# EAGLE design Temp_board_v4.0 (EAGLE 8.0.0)
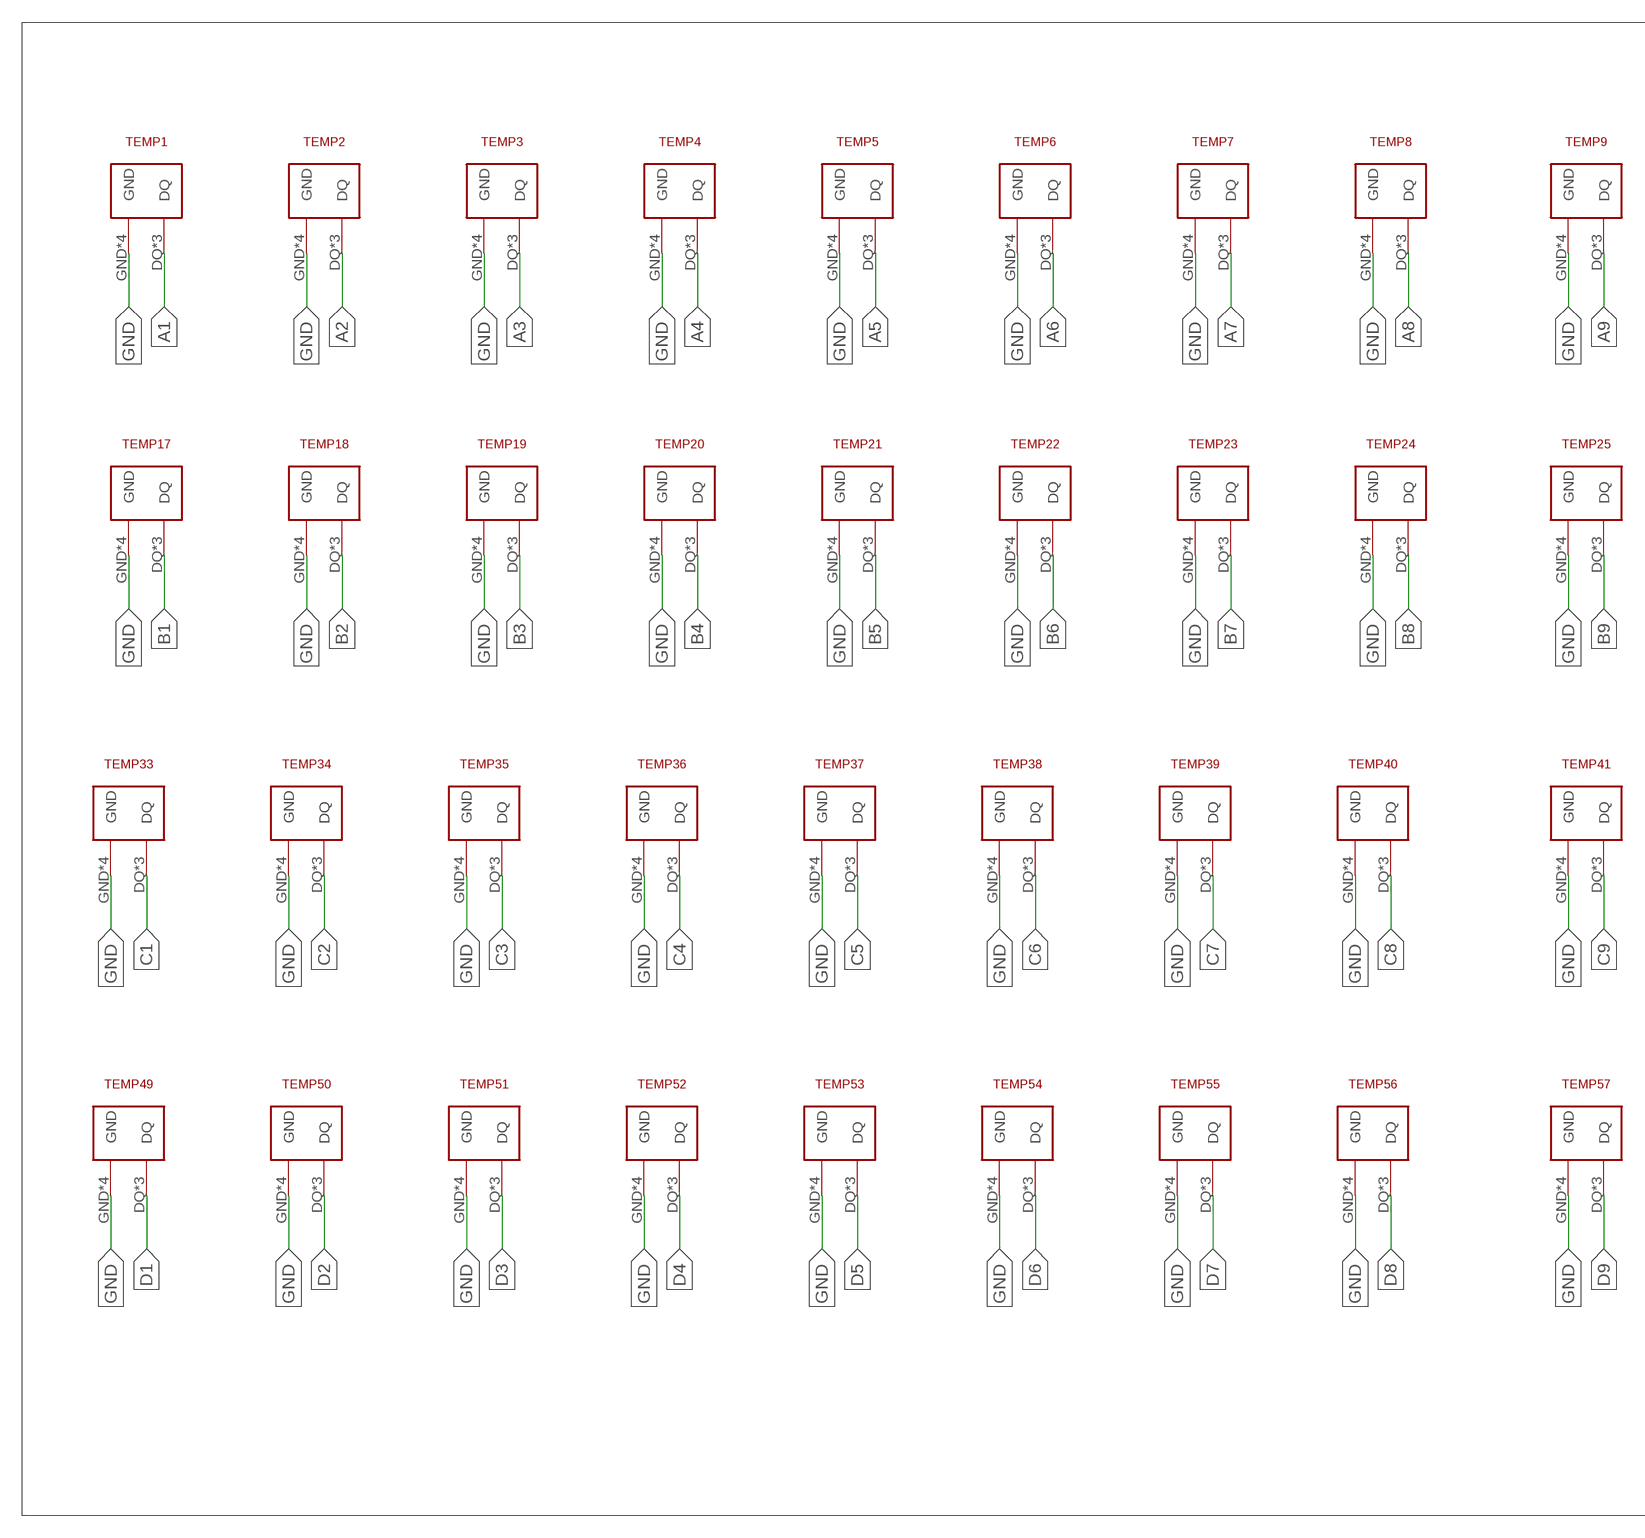
[diagram p0: schematic, sheet 1, part 1 of 2]
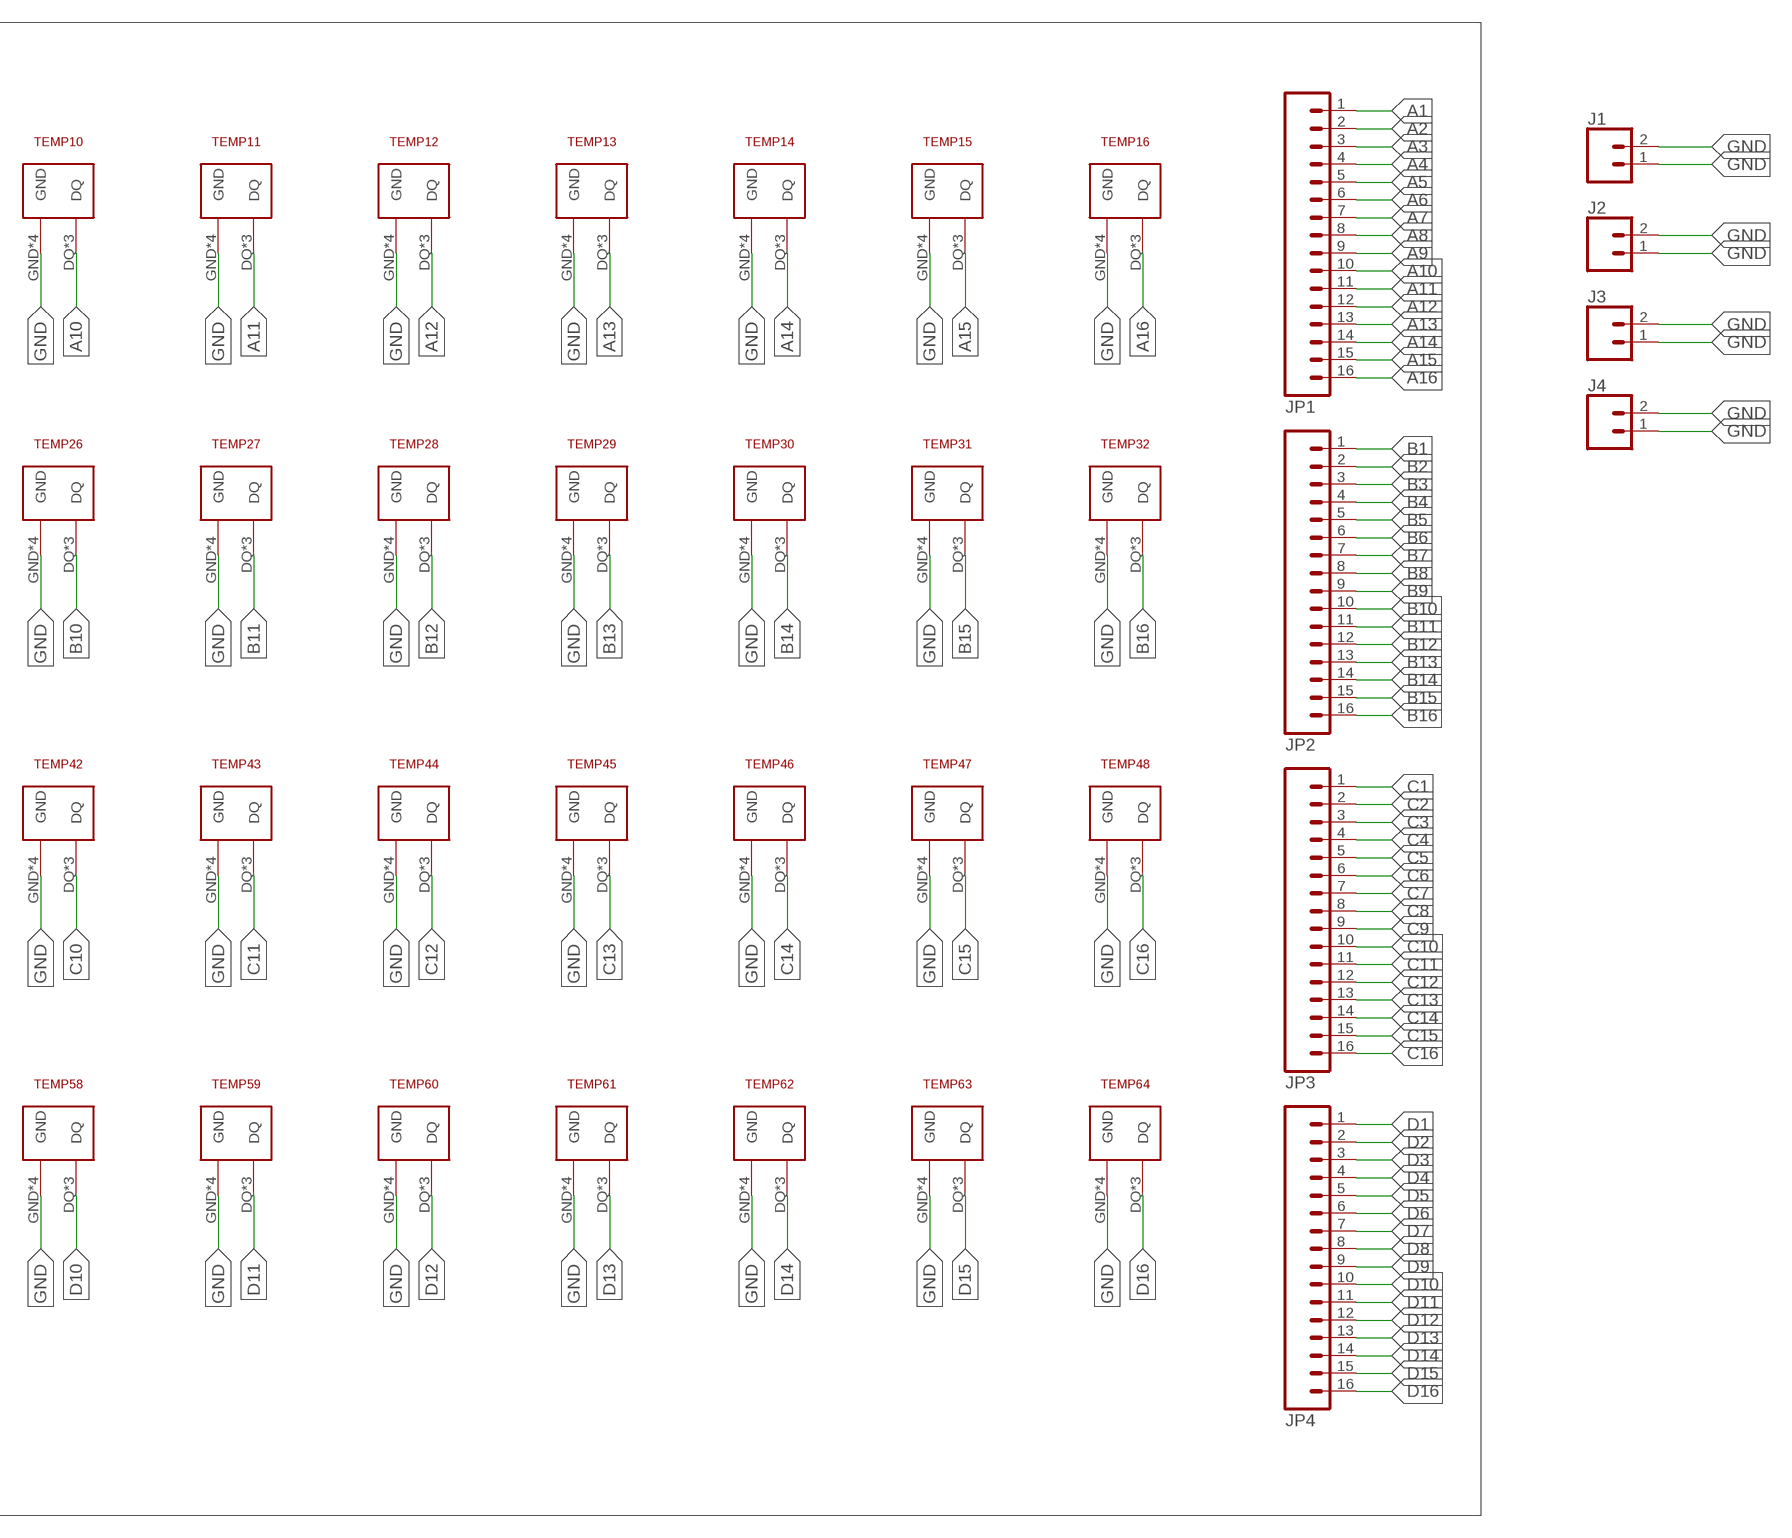
[diagram p1: schematic, sheet 1, part 2 of 2]

## Parts
J1  CONN_02  [1X02]
J2  CONN_02  [1X02]
J3  CONN_02  [1X02]
J4  CONN_02  [1X02]
JP1  M16PTH  [1X16]
JP2  M16PTH  [1X16]
JP3  M16PTH  [1X16]
JP4  M16PTH  [1X16]
TEMP1  TEMP_TEST_ALL  [TEMP_TEST_PACKAGE]
TEMP2  TEMP_TEST_ALL  [TEMP_TEST_PACKAGE]
TEMP3  TEMP_TEST_ALL  [TEMP_TEST_PACKAGE]
TEMP4  TEMP_TEST_ALL  [TEMP_TEST_PACKAGE]
TEMP5  TEMP_TEST_ALL  [TEMP_TEST_PACKAGE]
TEMP6  TEMP_TEST_ALL  [TEMP_TEST_PACKAGE]
TEMP7  TEMP_TEST_ALL  [TEMP_TEST_PACKAGE]
TEMP8  TEMP_TEST_ALL  [TEMP_TEST_PACKAGE]
TEMP9  TEMP_TEST_ALL  [TEMP_TEST_PACKAGE]
TEMP10  TEMP_TEST_ALL  [TEMP_TEST_PACKAGE]
TEMP11  TEMP_TEST_ALL  [TEMP_TEST_PACKAGE]
TEMP12  TEMP_TEST_ALL  [TEMP_TEST_PACKAGE]
TEMP13  TEMP_TEST_ALL  [TEMP_TEST_PACKAGE]
TEMP14  TEMP_TEST_ALL  [TEMP_TEST_PACKAGE]
TEMP15  TEMP_TEST_ALL  [TEMP_TEST_PACKAGE]
TEMP16  TEMP_TEST_ALL  [TEMP_TEST_PACKAGE]
TEMP17  TEMP_TEST_ALL  [TEMP_TEST_PACKAGE]
TEMP18  TEMP_TEST_ALL  [TEMP_TEST_PACKAGE]
TEMP19  TEMP_TEST_ALL  [TEMP_TEST_PACKAGE]
TEMP20  TEMP_TEST_ALL  [TEMP_TEST_PACKAGE]
TEMP21  TEMP_TEST_ALL  [TEMP_TEST_PACKAGE]
TEMP22  TEMP_TEST_ALL  [TEMP_TEST_PACKAGE]
TEMP23  TEMP_TEST_ALL  [TEMP_TEST_PACKAGE]
TEMP24  TEMP_TEST_ALL  [TEMP_TEST_PACKAGE]
TEMP25  TEMP_TEST_ALL  [TEMP_TEST_PACKAGE]
TEMP26  TEMP_TEST_ALL  [TEMP_TEST_PACKAGE]
TEMP27  TEMP_TEST_ALL  [TEMP_TEST_PACKAGE]
TEMP28  TEMP_TEST_ALL  [TEMP_TEST_PACKAGE]
TEMP29  TEMP_TEST_ALL  [TEMP_TEST_PACKAGE]
TEMP30  TEMP_TEST_ALL  [TEMP_TEST_PACKAGE]
TEMP31  TEMP_TEST_ALL  [TEMP_TEST_PACKAGE]
TEMP32  TEMP_TEST_ALL  [TEMP_TEST_PACKAGE]
TEMP33  TEMP_TEST_ALL  [TEMP_TEST_PACKAGE]
TEMP34  TEMP_TEST_ALL  [TEMP_TEST_PACKAGE]
TEMP35  TEMP_TEST_ALL  [TEMP_TEST_PACKAGE]
TEMP36  TEMP_TEST_ALL  [TEMP_TEST_PACKAGE]
TEMP37  TEMP_TEST_ALL  [TEMP_TEST_PACKAGE]
TEMP38  TEMP_TEST_ALL  [TEMP_TEST_PACKAGE]
TEMP39  TEMP_TEST_ALL  [TEMP_TEST_PACKAGE]
TEMP40  TEMP_TEST_ALL  [TEMP_TEST_PACKAGE]
TEMP41  TEMP_TEST_ALL  [TEMP_TEST_PACKAGE]
TEMP42  TEMP_TEST_ALL  [TEMP_TEST_PACKAGE]
TEMP43  TEMP_TEST_ALL  [TEMP_TEST_PACKAGE]
TEMP44  TEMP_TEST_ALL  [TEMP_TEST_PACKAGE]
TEMP45  TEMP_TEST_ALL  [TEMP_TEST_PACKAGE]
TEMP46  TEMP_TEST_ALL  [TEMP_TEST_PACKAGE]
TEMP47  TEMP_TEST_ALL  [TEMP_TEST_PACKAGE]
TEMP48  TEMP_TEST_ALL  [TEMP_TEST_PACKAGE]
TEMP49  TEMP_TEST_ALL  [TEMP_TEST_PACKAGE]
TEMP50  TEMP_TEST_ALL  [TEMP_TEST_PACKAGE]
TEMP51  TEMP_TEST_ALL  [TEMP_TEST_PACKAGE]
TEMP52  TEMP_TEST_ALL  [TEMP_TEST_PACKAGE]
TEMP53  TEMP_TEST_ALL  [TEMP_TEST_PACKAGE]
TEMP54  TEMP_TEST_ALL  [TEMP_TEST_PACKAGE]
TEMP55  TEMP_TEST_ALL  [TEMP_TEST_PACKAGE]
TEMP56  TEMP_TEST_ALL  [TEMP_TEST_PACKAGE]
TEMP57  TEMP_TEST_ALL  [TEMP_TEST_PACKAGE]
TEMP58  TEMP_TEST_ALL  [TEMP_TEST_PACKAGE]
TEMP59  TEMP_TEST_ALL  [TEMP_TEST_PACKAGE]
TEMP60  TEMP_TEST_ALL  [TEMP_TEST_PACKAGE]
TEMP61  TEMP_TEST_ALL  [TEMP_TEST_PACKAGE]
TEMP62  TEMP_TEST_ALL  [TEMP_TEST_PACKAGE]
TEMP63  TEMP_TEST_ALL  [TEMP_TEST_PACKAGE]
TEMP64  TEMP_TEST_ALL  [TEMP_TEST_PACKAGE]

## Nets
A1: JP1.1 TEMP1.DQ TEMP1.DQ1(DQ) TEMP1.DQ2(DQ)
A2: JP1.2 TEMP2.DQ TEMP2.DQ1(DQ) TEMP2.DQ2(DQ)
A3: JP1.3 TEMP3.DQ TEMP3.DQ1(DQ) TEMP3.DQ2(DQ)
A4: JP1.4 TEMP4.DQ TEMP4.DQ1(DQ) TEMP4.DQ2(DQ)
A5: JP1.5 TEMP5.DQ TEMP5.DQ1(DQ) TEMP5.DQ2(DQ)
A6: JP1.6 TEMP6.DQ TEMP6.DQ1(DQ) TEMP6.DQ2(DQ)
A7: JP1.7 TEMP7.DQ TEMP7.DQ1(DQ) TEMP7.DQ2(DQ)
A8: JP1.8 TEMP8.DQ TEMP8.DQ1(DQ) TEMP8.DQ2(DQ)
A9: JP1.9 TEMP9.DQ TEMP9.DQ1(DQ) TEMP9.DQ2(DQ)
A10: JP1.10 TEMP10.DQ TEMP10.DQ1(DQ) TEMP10.DQ2(DQ)
A11: JP1.11 TEMP11.DQ TEMP11.DQ1(DQ) TEMP11.DQ2(DQ)
A12: JP1.12 TEMP12.DQ TEMP12.DQ1(DQ) TEMP12.DQ2(DQ)
A13: JP1.13 TEMP13.DQ TEMP13.DQ1(DQ) TEMP13.DQ2(DQ)
A14: JP1.14 TEMP14.DQ TEMP14.DQ1(DQ) TEMP14.DQ2(DQ)
A15: JP1.15 TEMP15.DQ TEMP15.DQ1(DQ) TEMP15.DQ2(DQ)
A16: JP1.16 TEMP16.DQ TEMP16.DQ1(DQ) TEMP16.DQ2(DQ)
B1: JP2.1 TEMP17.DQ TEMP17.DQ1(DQ) TEMP17.DQ2(DQ)
B2: JP2.2 TEMP18.DQ TEMP18.DQ1(DQ) TEMP18.DQ2(DQ)
B3: JP2.3 TEMP19.DQ TEMP19.DQ1(DQ) TEMP19.DQ2(DQ)
B4: JP2.4 TEMP20.DQ TEMP20.DQ1(DQ) TEMP20.DQ2(DQ)
B5: JP2.5 TEMP21.DQ TEMP21.DQ1(DQ) TEMP21.DQ2(DQ)
B6: JP2.6 TEMP22.DQ TEMP22.DQ1(DQ) TEMP22.DQ2(DQ)
B7: JP2.7 TEMP23.DQ TEMP23.DQ1(DQ) TEMP23.DQ2(DQ)
B8: JP2.8 TEMP24.DQ TEMP24.DQ1(DQ) TEMP24.DQ2(DQ)
B9: JP2.9 TEMP25.DQ TEMP25.DQ1(DQ) TEMP25.DQ2(DQ)
B10: JP2.10 TEMP26.DQ TEMP26.DQ1(DQ) TEMP26.DQ2(DQ)
B11: JP2.11 TEMP27.DQ TEMP27.DQ1(DQ) TEMP27.DQ2(DQ)
B12: JP2.12 TEMP28.DQ TEMP28.DQ1(DQ) TEMP28.DQ2(DQ)
B13: JP2.13 TEMP29.DQ TEMP29.DQ1(DQ) TEMP29.DQ2(DQ)
B14: JP2.14 TEMP30.DQ TEMP30.DQ1(DQ) TEMP30.DQ2(DQ)
B15: JP2.15 TEMP31.DQ TEMP31.DQ1(DQ) TEMP31.DQ2(DQ)
B16: JP2.16 TEMP32.DQ TEMP32.DQ1(DQ) TEMP32.DQ2(DQ)
C1: JP3.1 TEMP33.DQ TEMP33.DQ1(DQ) TEMP33.DQ2(DQ)
C2: JP3.2 TEMP34.DQ TEMP34.DQ1(DQ) TEMP34.DQ2(DQ)
C3: JP3.3 TEMP35.DQ TEMP35.DQ1(DQ) TEMP35.DQ2(DQ)
C4: JP3.4 TEMP36.DQ TEMP36.DQ1(DQ) TEMP36.DQ2(DQ)
C5: JP3.5 TEMP37.DQ TEMP37.DQ1(DQ) TEMP37.DQ2(DQ)
C6: JP3.6 TEMP38.DQ TEMP38.DQ1(DQ) TEMP38.DQ2(DQ)
C7: JP3.7 TEMP39.DQ TEMP39.DQ1(DQ) TEMP39.DQ2(DQ)
C8: JP3.8 TEMP40.DQ TEMP40.DQ1(DQ) TEMP40.DQ2(DQ)
C9: JP3.9 TEMP41.DQ TEMP41.DQ1(DQ) TEMP41.DQ2(DQ)
C10: JP3.10 TEMP42.DQ TEMP42.DQ1(DQ) TEMP42.DQ2(DQ)
C11: JP3.11 TEMP43.DQ TEMP43.DQ1(DQ) TEMP43.DQ2(DQ)
C12: JP3.12 TEMP44.DQ TEMP44.DQ1(DQ) TEMP44.DQ2(DQ)
C13: JP3.13 TEMP45.DQ TEMP45.DQ1(DQ) TEMP45.DQ2(DQ)
C14: JP3.14 TEMP46.DQ TEMP46.DQ1(DQ) TEMP46.DQ2(DQ)
C15: JP3.15 TEMP47.DQ TEMP47.DQ1(DQ) TEMP47.DQ2(DQ)
C16: JP3.16 TEMP48.DQ TEMP48.DQ1(DQ) TEMP48.DQ2(DQ)
D1: JP4.1 TEMP49.DQ TEMP49.DQ1(DQ) TEMP49.DQ2(DQ)
D2: JP4.2 TEMP50.DQ TEMP50.DQ1(DQ) TEMP50.DQ2(DQ)
D3: JP4.3 TEMP51.DQ TEMP51.DQ1(DQ) TEMP51.DQ2(DQ)
D4: JP4.4 TEMP52.DQ TEMP52.DQ1(DQ) TEMP52.DQ2(DQ)
D5: JP4.5 TEMP53.DQ TEMP53.DQ1(DQ) TEMP53.DQ2(DQ)
D6: JP4.6 TEMP54.DQ TEMP54.DQ1(DQ) TEMP54.DQ2(DQ)
D7: JP4.7 TEMP55.DQ TEMP55.DQ1(DQ) TEMP55.DQ2(DQ)
D8: JP4.8 TEMP56.DQ TEMP56.DQ1(DQ) TEMP56.DQ2(DQ)
D9: JP4.9 TEMP57.DQ TEMP57.DQ1(DQ) TEMP57.DQ2(DQ)
D10: JP4.10 TEMP58.DQ TEMP58.DQ1(DQ) TEMP58.DQ2(DQ)
D11: JP4.11 TEMP59.DQ TEMP59.DQ1(DQ) TEMP59.DQ2(DQ)
D12: JP4.12 TEMP60.DQ TEMP60.DQ1(DQ) TEMP60.DQ2(DQ)
D13: JP4.13 TEMP61.DQ TEMP61.DQ1(DQ) TEMP61.DQ2(DQ)
D14: JP4.14 TEMP62.DQ TEMP62.DQ1(DQ) TEMP62.DQ2(DQ)
D15: JP4.15 TEMP63.DQ TEMP63.DQ1(DQ) TEMP63.DQ2(DQ)
D16: JP4.16 TEMP64.DQ TEMP64.DQ1(DQ) TEMP64.DQ2(DQ)
GND: J1.1 J1.2 J2.1 J2.2 J3.1 J3.2 J4.1 J4.2 TEMP1.GND TEMP1.GND1(GND) TEMP1.GND2(GND) TEMP1.VDD(GND) TEMP2.GND TEMP2.GND1(GND) TEMP2.GND2(GND) TEMP2.VDD(GND) TEMP3.GND TEMP3.GND1(GND) TEMP3.GND2(GND) TEMP3.VDD(GND) TEMP4.GND TEMP4.GND1(GND) TEMP4.GND2(GND) TEMP4.VDD(GND) TEMP5.GND TEMP5.GND1(GND) TEMP5.GND2(GND) TEMP5.VDD(GND) TEMP6.GND TEMP6.GND1(GND) TEMP6.GND2(GND) TEMP6.VDD(GND) TEMP7.GND TEMP7.GND1(GND) TEMP7.GND2(GND) TEMP7.VDD(GND) TEMP8.GND TEMP8.GND1(GND) TEMP8.GND2(GND) TEMP8.VDD(GND) TEMP9.GND TEMP9.GND1(GND) TEMP9.GND2(GND) TEMP9.VDD(GND) TEMP10.GND TEMP10.GND1(GND) TEMP10.GND2(GND) TEMP10.VDD(GND) TEMP11.GND TEMP11.GND1(GND) TEMP11.GND2(GND) TEMP11.VDD(GND) TEMP12.GND TEMP12.GND1(GND) TEMP12.GND2(GND) TEMP12.VDD(GND) TEMP13.GND TEMP13.GND1(GND) TEMP13.GND2(GND) TEMP13.VDD(GND) TEMP14.GND TEMP14.GND1(GND) TEMP14.GND2(GND) TEMP14.VDD(GND) TEMP15.GND TEMP15.GND1(GND) TEMP15.GND2(GND) TEMP15.VDD(GND) TEMP16.GND TEMP16.GND1(GND) TEMP16.GND2(GND) TEMP16.VDD(GND) TEMP17.GND TEMP17.GND1(GND) TEMP17.GND2(GND) TEMP17.VDD(GND) TEMP18.GND TEMP18.GND1(GND) TEMP18.GND2(GND) TEMP18.VDD(GND) TEMP19.GND TEMP19.GND1(GND) TEMP19.GND2(GND) TEMP19.VDD(GND) TEMP20.GND TEMP20.GND1(GND) TEMP20.GND2(GND) TEMP20.VDD(GND) TEMP21.GND TEMP21.GND1(GND) TEMP21.GND2(GND) TEMP21.VDD(GND) TEMP22.GND TEMP22.GND1(GND) TEMP22.GND2(GND) TEMP22.VDD(GND) TEMP23.GND TEMP23.GND1(GND) TEMP23.GND2(GND) TEMP23.VDD(GND) TEMP24.GND TEMP24.GND1(GND) TEMP24.GND2(GND) TEMP24.VDD(GND) TEMP25.GND TEMP25.GND1(GND) TEMP25.GND2(GND) TEMP25.VDD(GND) TEMP26.GND TEMP26.GND1(GND) TEMP26.GND2(GND) TEMP26.VDD(GND) TEMP27.GND TEMP27.GND1(GND) TEMP27.GND2(GND) TEMP27.VDD(GND) TEMP28.GND TEMP28.GND1(GND) TEMP28.GND2(GND) TEMP28.VDD(GND) TEMP29.GND TEMP29.GND1(GND) TEMP29.GND2(GND) TEMP29.VDD(GND) TEMP30.GND TEMP30.GND1(GND) TEMP30.GND2(GND) TEMP30.VDD(GND) TEMP31.GND TEMP31.GND1(GND) TEMP31.GND2(GND) TEMP31.VDD(GND) TEMP32.GND TEMP32.GND1(GND) TEMP32.GND2(GND) TEMP32.VDD(GND) TEMP33.GND TEMP33.GND1(GND) TEMP33.GND2(GND) TEMP33.VDD(GND) TEMP34.GND TEMP34.GND1(GND) TEMP34.GND2(GND) TEMP34.VDD(GND) TEMP35.GND TEMP35.GND1(GND) TEMP35.GND2(GND) TEMP35.VDD(GND) TEMP36.GND TEMP36.GND1(GND) TEMP36.GND2(GND) TEMP36.VDD(GND) TEMP37.GND TEMP37.GND1(GND) TEMP37.GND2(GND) TEMP37.VDD(GND) TEMP38.GND TEMP38.GND1(GND) TEMP38.GND2(GND) TEMP38.VDD(GND) TEMP39.GND TEMP39.GND1(GND) TEMP39.GND2(GND) TEMP39.VDD(GND) TEMP40.GND TEMP40.GND1(GND) TEMP40.GND2(GND) TEMP40.VDD(GND) TEMP41.GND TEMP41.GND1(GND) TEMP41.GND2(GND) TEMP41.VDD(GND) TEMP42.GND TEMP42.GND1(GND) TEMP42.GND2(GND) TEMP42.VDD(GND) TEMP43.GND TEMP43.GND1(GND) TEMP43.GND2(GND) TEMP43.VDD(GND) TEMP44.GND TEMP44.GND1(GND) TEMP44.GND2(GND) TEMP44.VDD(GND) TEMP45.GND TEMP45.GND1(GND) TEMP45.GND2(GND) TEMP45.VDD(GND) TEMP46.GND TEMP46.GND1(GND) TEMP46.GND2(GND) TEMP46.VDD(GND) TEMP47.GND TEMP47.GND1(GND) TEMP47.GND2(GND) TEMP47.VDD(GND) TEMP48.GND TEMP48.GND1(GND) TEMP48.GND2(GND) TEMP48.VDD(GND) TEMP49.GND TEMP49.GND1(GND) TEMP49.GND2(GND) TEMP49.VDD(GND) TEMP50.GND TEMP50.GND1(GND) TEMP50.GND2(GND) TEMP50.VDD(GND) TEMP51.GND TEMP51.GND1(GND) TEMP51.GND2(GND) TEMP51.VDD(GND) TEMP52.GND TEMP52.GND1(GND) TEMP52.GND2(GND) TEMP52.VDD(GND) TEMP53.GND TEMP53.GND1(GND) TEMP53.GND2(GND) TEMP53.VDD(GND) TEMP54.GND TEMP54.GND1(GND) TEMP54.GND2(GND) TEMP54.VDD(GND) TEMP55.GND TEMP55.GND1(GND) TEMP55.GND2(GND) TEMP55.VDD(GND) TEMP56.GND TEMP56.GND1(GND) TEMP56.GND2(GND) TEMP56.VDD(GND) TEMP57.GND TEMP57.GND1(GND) TEMP57.GND2(GND) TEMP57.VDD(GND) TEMP58.GND TEMP58.GND1(GND) TEMP58.GND2(GND) TEMP58.VDD(GND) TEMP59.GND TEMP59.GND1(GND) TEMP59.GND2(GND) TEMP59.VDD(GND) TEMP60.GND TEMP60.GND1(GND) TEMP60.GND2(GND) TEMP60.VDD(GND) TEMP61.GND TEMP61.GND1(GND) TEMP61.GND2(GND) TEMP61.VDD(GND) TEMP62.GND TEMP62.GND1(GND) TEMP62.GND2(GND) TEMP62.VDD(GND) TEMP63.GND TEMP63.GND1(GND) TEMP63.GND2(GND) TEMP63.VDD(GND) TEMP64.GND TEMP64.GND1(GND) TEMP64.GND2(GND) TEMP64.VDD(GND)

## Library data of the parts
J1-J4 = SparkFun-Connectors:CONN_02: Multi connection point. Often used as Generic Header-pin footprint for 0.1 inch spaced/style header connections On any of the 0.1 inch spaced packages, you can populate with these: Break Away Headers - Straight <https://www.sparkfun.com/products/116> (PRT-00116) Break Away Male Headers - Right Angle <https://www.sparkfun.com/products/553> (PRT-00553) Female Headers <https://www.sparkfun.com/products/115> (PRT-00115) Break Away Headers - Machine Pin <https://www.sparkfun.com/products/117> (PRT-00117) Break Away Female Headers - Swiss Machine Pin <https://www.sparkfun.com/products/743> (PRT-00743) For SCREWTERMINALS and SPRING TERMINALS visit here: Screw Terimnals on SparkFun.com <https://www.sparkfun.com/search/results?term=Screw+Terminals> (5mm/3.5mm/2.54mm spacing) This device is also useful as a general connection point to wire up your design to another part of your project. Our various solder wires solder well into these plated through hole pads. Hook-Up Wire - Assortment (Stranded, 22 AWG) <https://www.sparkfun.com/products/11375> (PRT-11375) Hook-Up Wire - Assortment (Solid Core, 22 AWG) <https://www.sparkfun.com/products/11367> (PRT-11367) View the entire wire category on our website here <https://www.sparkfun.com/categories/141> Special notes: Molex polarized connector foot print use with: PRT-08233 with associated crimp pins and housings. 2.54_SCREWTERM for use with PRT-10571. 3.5mm Screw Terminal footprints for PRT-08084 5mm Screw Terminal footprints for use with PRT-08432
JP1-JP4 = SparkFun-Connectors:M16: 1x16 .1" header
TEMP1-TEMP64 = UIO-John:TEMP_TEST_ALL

## Board
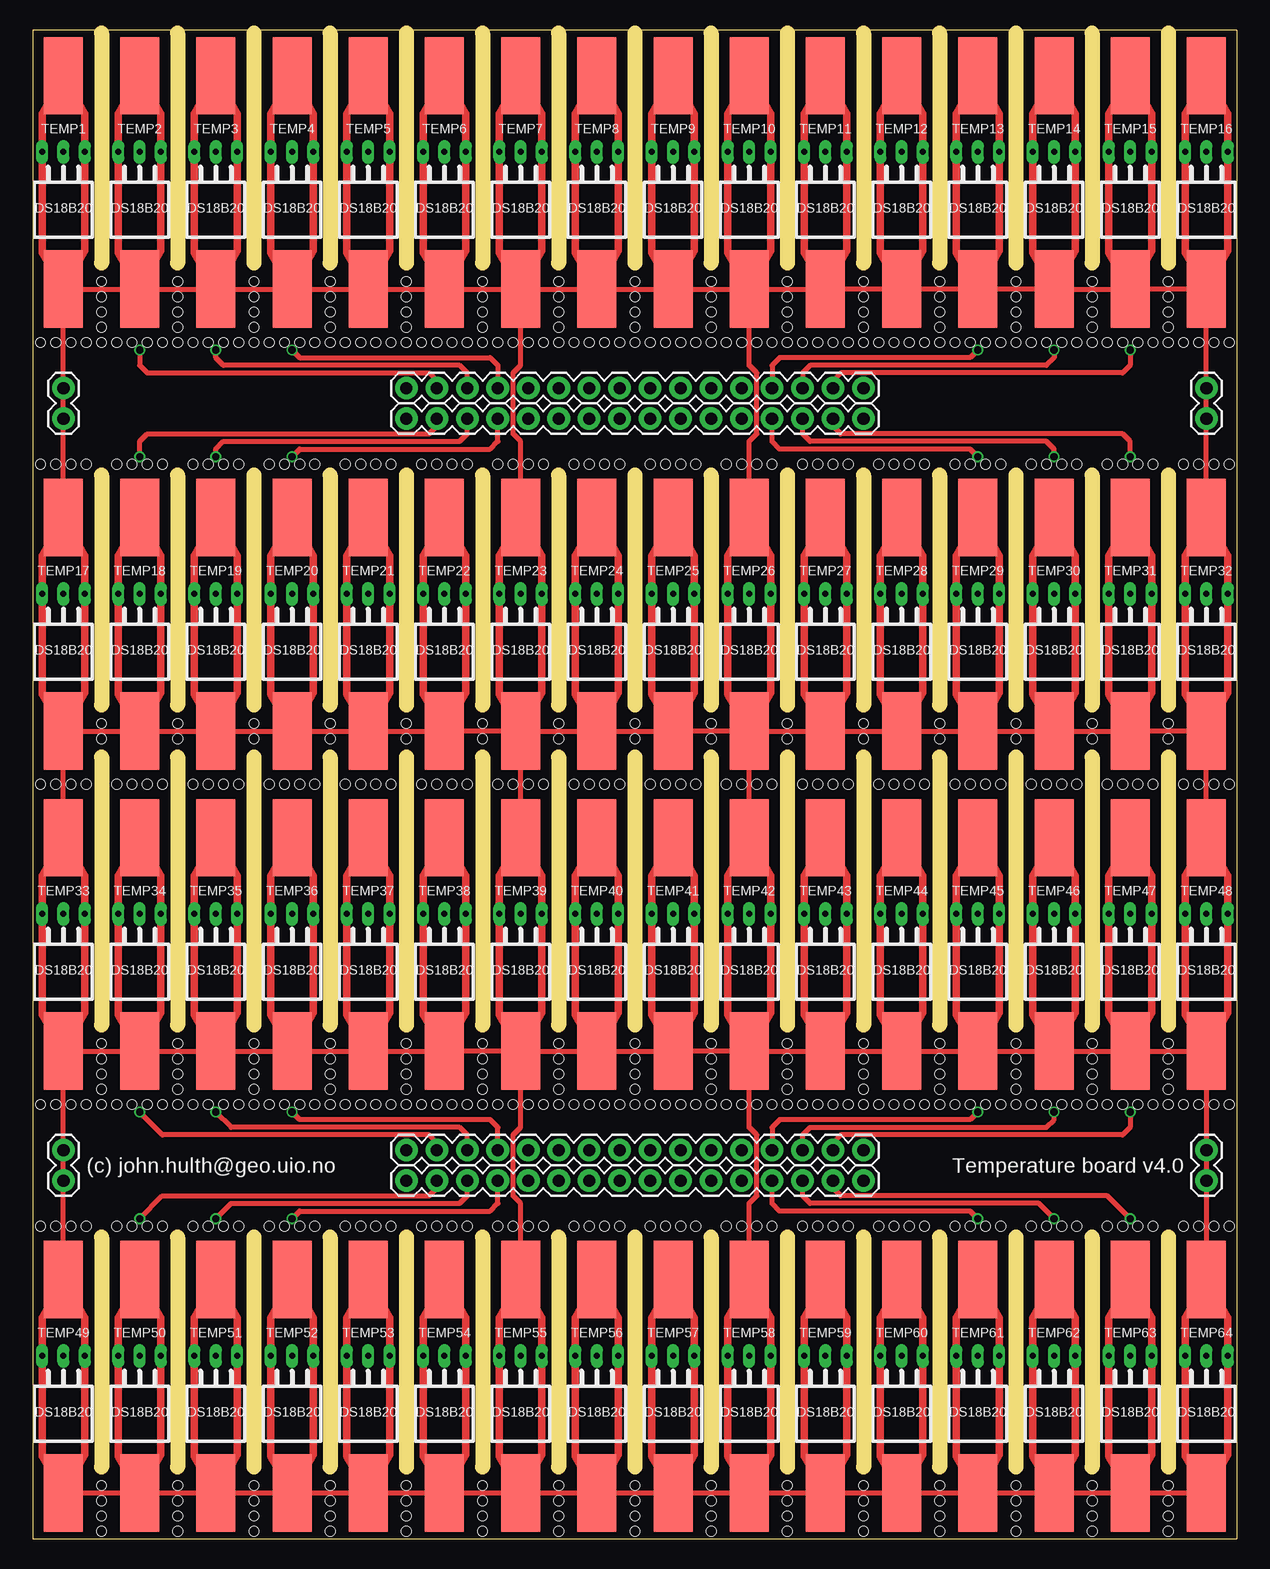
[diagram p2: board, top side]
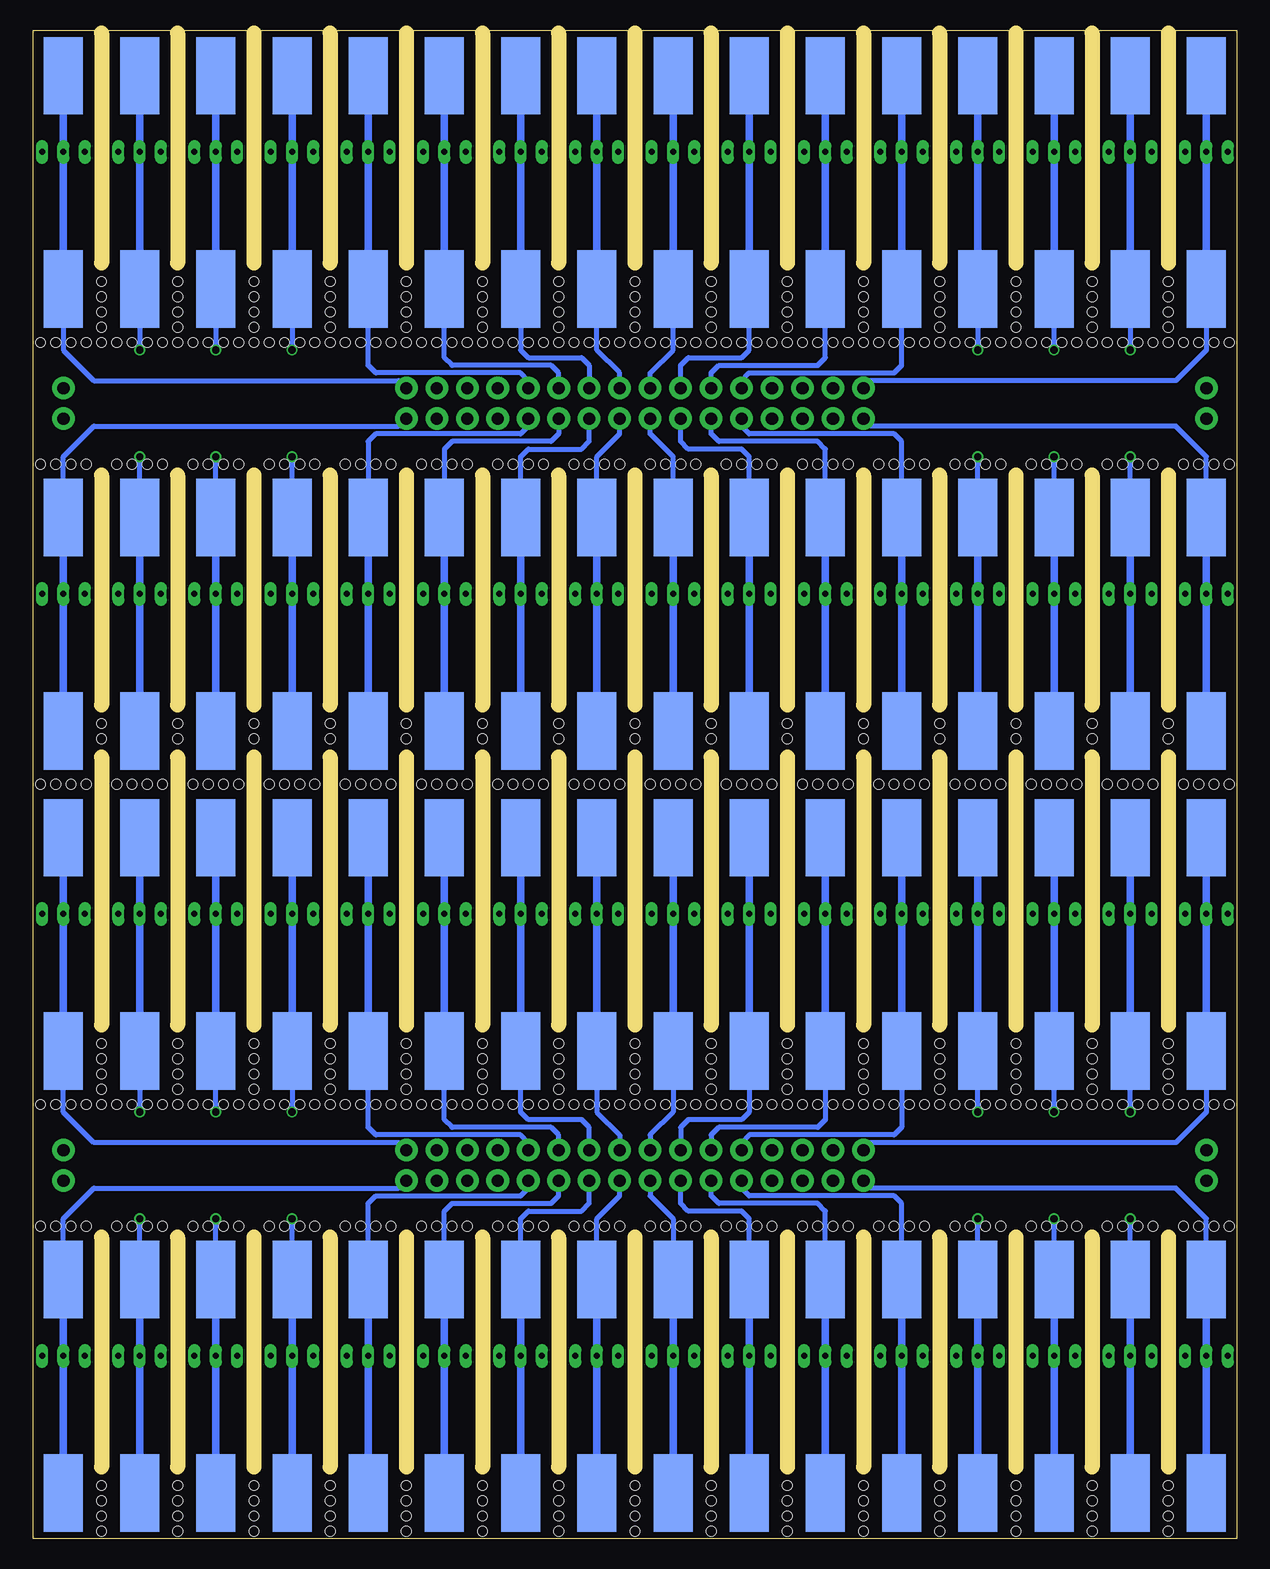
[diagram p3: board, bottom side, seen from below]

Size 100.33 x 125.73 mm. Coordinates in mm from the lower left corner, seen from the top.
Outline: 0,0 100.33,0 100.33,125.73 0,125.73 0,0
Copper layers (1*16): Top 0.035mm / dielectric 1.5mm / Bottom 0.035mm
Design rules "dirt_cheap_dirty_boards.v1": minimum track width 5mil, minimum drill 12mil, track to track 5mil, track to pad 5mil, pad to pad 5mil, via to via 5mil, smd to smd 0mil, copper to edge 10mil, drill to drill 10mil, minimum pad ring 10mil, minimum via ring 6mil, stop-mask expansion 2mil, vias tented up to drill 25mil, thermal gap 10mil
Holes 0.8 mm at 5.71,104.78 5.71,103.5 62.87,104.78 62.87,103.5 3.17,89.53 4.45,89.53 0.64,89.53 1.91,89.53 12.06,104.78 12.06,103.5 69.22,104.78 69.22,103.5 9.53,89.53 10.79,89.53 6.99,89.53 8.26,89.53 18.41,104.78 18.41,103.5 75.56,104.78 75.56,103.5 15.88,89.53 17.14,89.53 13.34,89.53 14.61,89.53 24.77,104.78 24.77,103.5 81.92,104.78 81.92,103.5 22.23,89.53 23.5,89.53 19.68,89.53 20.95,89.53 31.11,104.78 31.11,103.5 88.27,104.78 88.27,103.5 28.57,89.53 29.84,89.53 26.04,89.53 27.3,89.53 37.47,104.78 37.47,103.5 94.61,104.78 94.61,103.5 34.92,89.53 36.2,89.53 32.38,89.53 33.66,89.53 43.81,104.78 43.81,103.5 41.27,89.53 42.55,89.53 38.73,89.53 40.01,89.53 50.16,104.78 50.16,103.5 47.62,89.53 48.9,89.53 45.09,89.53 46.35,89.53 3.17,26.04 4.45,26.04 0.64,26.04 1.91,26.04 9.53,26.04 10.79,26.04 6.99,26.04 8.26,26.04 15.88,26.04 17.14,26.04 13.34,26.04 14.61,26.04 22.23,26.04 23.5,26.04 19.68,26.04 20.95,26.04 28.57,26.04 29.84,26.04 26.04,26.04 27.3,26.04 34.92,26.04 36.2,26.04 32.38,26.04 33.66,26.04 41.27,26.04 42.55,26.04 38.73,26.04 40.01,26.04 47.62,26.04 48.9,26.04 45.09,26.04 46.35,26.04 5.71,67.94 5.71,66.67 60.33,89.53 61.59,89.53 57.78,89.53 59.05,89.53 12.06,67.94 12.06,66.67 66.67,89.53 67.94,89.53 64.14,89.53 65.41,89.53 18.41,67.94 18.41,66.67 73.03,89.53 74.3,89.53 70.48,89.53 71.75,89.53 24.77,67.94 24.77,66.67 79.38,89.53 80.64,89.53 76.83,89.53 78.11,89.53 31.11,67.94 31.11,66.67 85.72,89.53 87,89.53 83.19,89.53 84.45,89.53 37.47,67.94 37.47,66.67 92.08,89.53 93.34,89.53 89.53,89.53 90.81,89.53 43.81,67.94 43.81,66.67 98.42,89.53 99.69,89.53 95.89,89.53 97.16,89.53 50.16,67.94 50.16,66.67 5.71,4.45 5.71,3.17 53.98,26.04 55.24,26.04 51.44,26.04 52.7,26.04 12.06,4.45 12.06,3.17 60.33,26.04 61.59,26.04 57.78,26.04 59.05,26.04 18.41,4.45 18.41,3.17 66.67,26.04 67.94,26.04 64.14,26.04 65.41,26.04 24.77,4.45 24.77,3.17 73.03,26.04 74.3,26.04 70.48,26.04 71.75,26.04 31.11,4.45 31.11,3.17 79.38,26.04 80.64,26.04 76.83,26.04 78.11,26.04 37.47,4.45 37.47,3.17 85.72,26.04 87,26.04 83.19,26.04 84.45,26.04 43.81,4.45 43.81,3.17 92.08,26.04 93.34,26.04 89.53,26.04 90.81,26.04 50.16,4.45 50.16,3.17 98.42,26.04 99.69,26.04 95.89,26.04 97.16,26.04 56.52,67.94 56.52,66.67 3.17,62.87 4.45,62.87 0.64,62.87 1.91,62.87 62.87,67.94 62.87,66.67 9.53,62.87 10.79,62.87 6.99,62.87 8.26,62.87 69.22,67.94 69.22,66.67 15.88,62.87 17.14,62.87 13.34,62.87 14.61,62.87 75.56,67.94 75.56,66.67 22.23,62.87 23.5,62.87 19.68,62.87 20.95,62.87 81.92,67.94 81.92,66.67 28.57,62.87 29.84,62.87 26.04,62.87 27.3,62.87 88.27,67.94 88.27,66.67 34.92,62.87 36.2,62.87 32.38,62.87 33.66,62.87 94.61,67.94 94.61,66.67 41.27,62.87 42.55,62.87 38.73,62.87 40.01,62.87 47.62,62.87 48.9,62.87 45.09,62.87 46.35,62.87 56.52,4.45 56.52,3.17 62.87,4.45 62.87,3.17 69.22,4.45 69.22,3.17 75.56,4.45 75.56,3.17 81.92,4.45 81.92,3.17 88.27,4.45 88.27,3.17 94.61,4.45 94.61,3.17 50.16,67.94 50.16,66.67 56.52,104.78 56.52,103.5 53.98,62.87 55.24,62.87 51.44,62.87 52.7,62.87 60.33,62.87 61.59,62.87 57.78,62.87 59.05,62.87 66.67,62.87 67.94,62.87 64.14,62.87 65.41,62.87 73.03,62.87 74.3,62.87 70.48,62.87 71.75,62.87 79.38,62.87 80.64,62.87 76.83,62.87 78.11,62.87 85.72,62.87 87,62.87 83.19,62.87 84.45,62.87 92.08,62.87 93.34,62.87 89.53,62.87 90.81,62.87 98.42,62.87 99.69,62.87 95.89,62.87 97.16,62.87 50.16,4.45 50.16,3.17 81.92,1.91 81.92,0.64 88.27,1.91 88.27,0.64 94.61,1.91 94.61,0.64 56.52,1.91 56.52,0.64 62.87,1.91 62.87,0.64 69.22,1.91 69.22,0.64 75.56,1.91 75.56,0.64 50.16,1.91 50.16,0.64 53.98,89.53 55.24,89.53 51.44,89.53 52.7,89.53 43.81,1.91 43.81,0.64 18.41,1.91 18.41,0.64 24.77,1.91 24.77,0.64 31.11,1.91 31.11,0.64 37.47,1.91 37.47,0.64 12.06,1.91 12.06,0.64 5.71,1.91 5.71,0.64 3.17,99.69 4.45,99.69 0.64,99.69 1.91,99.69 9.53,99.69 10.79,99.69 6.99,99.69 8.26,99.69 15.88,99.69 17.14,99.69 13.34,99.69 14.61,99.69 22.23,99.69 23.5,99.69 19.68,99.69 20.95,99.69 28.57,99.69 29.84,99.69 26.04,99.69 27.3,99.69 34.92,99.69 36.2,99.69 32.38,99.69 33.66,99.69 41.27,99.69 42.55,99.69 38.73,99.69 40.01,99.69 47.62,99.69 48.9,99.69 45.09,99.69 46.35,99.69 60.33,99.69 61.59,99.69 57.78,99.69 59.05,99.69 66.67,99.69 67.94,99.69 64.14,99.69 65.41,99.69 73.03,99.69 74.3,99.69 70.48,99.69 71.75,99.69 79.38,99.69 80.64,99.69 76.83,99.69 78.11,99.69 85.72,99.69 87,99.69 83.19,99.69 84.45,99.69 92.08,99.69 93.34,99.69 89.53,99.69 90.81,99.69 98.42,99.69 99.69,99.69 95.89,99.69 97.16,99.69 53.98,99.69 55.24,99.69 51.44,99.69 52.7,99.69 3.17,36.2 4.45,36.2 0.64,36.2 1.91,36.2 9.53,36.2 10.79,36.2 6.99,36.2 8.26,36.2 15.88,36.2 17.14,36.2 13.34,36.2 14.61,36.2 22.23,36.2 23.5,36.2 19.68,36.2 20.95,36.2 28.57,36.2 29.84,36.2 26.04,36.2 27.3,36.2 34.92,36.2 36.2,36.2 32.38,36.2 33.66,36.2 41.27,36.2 42.55,36.2 38.73,36.2 40.01,36.2 47.62,36.2 48.9,36.2 45.09,36.2 46.35,36.2 53.98,36.2 55.24,36.2 51.44,36.2 52.7,36.2 60.33,36.2 61.59,36.2 57.78,36.2 59.05,36.2 66.67,36.2 67.94,36.2 64.14,36.2 65.41,36.2 73.03,36.2 74.3,36.2 70.48,36.2 71.75,36.2 79.38,36.2 80.64,36.2 76.83,36.2 78.11,36.2 85.72,36.2 87,36.2 83.19,36.2 84.45,36.2 92.08,36.2 93.34,36.2 89.53,36.2 90.81,36.2 98.42,36.2 99.69,36.2 95.89,36.2 97.16,36.2 5.71,41.27 5.71,40.01 62.87,41.27 62.87,40.01 12.06,41.27 12.06,40.01 69.22,41.27 69.22,40.01 18.41,41.27 18.41,40.01 75.56,41.27 75.56,40.01 24.77,41.27 24.77,40.01 81.92,41.27 81.92,40.01 31.11,41.27 31.11,40.01 88.27,41.27 88.27,40.01 37.47,41.27 37.47,40.01 94.61,41.27 94.61,40.01 43.81,41.27 43.81,40.01 50.16,41.27 50.16,40.01 56.52,41.27 56.52,40.01 5.71,38.73 5.71,37.47 62.87,38.73 62.87,37.47 12.06,38.73 12.06,37.47 69.22,38.73 69.22,37.47 18.41,38.73 18.41,37.47 75.56,38.73 75.56,37.47 24.77,38.73 24.77,37.47 81.92,38.73 81.92,37.47 31.11,38.73 31.11,37.47 88.27,38.73 88.27,37.47 37.47,38.73 37.47,37.47 94.61,38.73 94.61,37.47 43.81,38.73 43.81,37.47 50.16,38.73 50.16,37.47 56.52,38.73 56.52,37.47 5.71,102.23 5.71,100.97 12.06,102.23 12.06,100.97 18.41,102.23 18.41,100.97 24.77,102.23 24.77,100.97 31.11,102.23 31.11,100.97 37.47,102.23 37.47,100.97 43.81,102.23 43.81,100.97 50.16,102.23 50.16,100.97 56.52,102.23 56.52,100.97 62.87,102.23 62.87,100.97 69.22,102.23 69.22,100.97 75.56,102.23 75.56,100.97 81.92,102.23 81.92,100.97 88.27,102.23 88.27,100.97 94.61,102.23 94.61,100.97 62.87,36.2 69.22,36.2 75.56,36.2 81.92,36.2 88.27,36.2 94.61,36.2 18.41,36.2 24.77,36.2 31.11,36.2 37.47,36.2 43.81,36.2 50.16,36.2 5.71,36.2 12.06,36.2 56.52,36.2 5.71,99.69 12.06,99.69 18.41,99.69 24.77,99.69 31.11,99.69 37.47,99.69 43.81,99.69 50.16,99.69 56.52,99.69 62.87,99.69 69.22,99.69 75.56,99.69 81.92,99.69 88.27,99.69 94.61,99.69
Milling: 60 lines

### Footprints (pad centres in the part's own frame; a part is rotated, then mirrored left to right if it is on the bottom)
1X02 = drill 1.016 pad 1.88: 1 0,0; 2 2.54,0
1X16 = drill 1.016 pad 1.88: 1 0,0; 2 2.54,0; 3 5.08,0; 4 7.62,0; 5 10.16,0; 6 12.7,0; 7 15.24,0; 8 17.78,0; 9 20.32,0; 10 22.86,0; 11 25.4,0; 12 27.94,0; 13 30.48,0; 14 33.02,0; 15 35.56,0; 16 38.1,0
TEMP_TEST_PACKAGE = drill 0.5 pad 0.813 long: DQ 0,0; GND -1.778,0; VDD 1.778,0 | smd 3.251 x 6.452 bottom: DQ1 0,-11.43; DQ2 0,6.35 | smd 3.251 x 6.452: GND1 0,-11.43; GND2 0,6.35

### Placement (x,y rotation side)
J1  2.54,93.34 90 top
J2  97.79,93.34 90 top
J3  2.54,29.84 90 top
J4  97.79,29.84 90 top
JP1  31.11,95.89 0 top
JP2  31.11,93.34 0 top
JP3  31.11,32.38 0 top
JP4  31.11,29.84 0 top
TEMP1  2.54,115.57 0 top
TEMP2  8.89,115.57 0 top
TEMP3  15.24,115.57 0 top
TEMP4  21.59,115.57 0 top
TEMP5  27.94,115.57 0 top
TEMP6  34.29,115.57 0 top
TEMP7  40.64,115.57 0 top
TEMP8  46.99,115.57 0 top
TEMP9  53.34,115.57 0 top
TEMP10  59.69,115.57 0 top
TEMP11  66.04,115.57 0 top
TEMP12  72.39,115.57 0 top
TEMP13  78.74,115.57 0 top
TEMP14  85.09,115.57 0 top
TEMP15  91.44,115.57 0 top
TEMP16  97.79,115.57 0 top
TEMP17  2.54,78.74 0 top
TEMP18  8.89,78.74 0 top
TEMP19  15.24,78.74 0 top
TEMP20  21.59,78.74 0 top
TEMP21  27.94,78.74 0 top
TEMP22  34.29,78.74 0 top
TEMP23  40.64,78.74 0 top
TEMP24  46.99,78.74 0 top
TEMP25  53.34,78.74 0 top
TEMP26  59.69,78.74 0 top
TEMP27  66.04,78.74 0 top
TEMP28  72.39,78.74 0 top
TEMP29  78.74,78.74 0 top
TEMP30  85.09,78.74 0 top
TEMP31  91.44,78.74 0 top
TEMP32  97.79,78.74 0 top
TEMP33  2.54,52.07 0 top
TEMP34  8.89,52.07 0 top
TEMP35  15.24,52.07 0 top
TEMP36  21.59,52.07 0 top
TEMP37  27.94,52.07 0 top
TEMP38  34.29,52.07 0 top
TEMP39  40.64,52.07 0 top
TEMP40  46.99,52.07 0 top
TEMP41  53.34,52.07 0 top
TEMP42  59.69,52.07 0 top
TEMP43  66.04,52.07 0 top
TEMP44  72.39,52.07 0 top
TEMP45  78.74,52.07 0 top
TEMP46  85.09,52.07 0 top
TEMP47  91.44,52.07 0 top
TEMP48  97.79,52.07 0 top
TEMP49  2.54,15.24 0 top
TEMP50  8.89,15.24 0 top
TEMP51  15.24,15.24 0 top
TEMP52  21.59,15.24 0 top
TEMP53  27.94,15.24 0 top
TEMP54  34.29,15.24 0 top
TEMP55  40.64,15.24 0 top
TEMP56  46.99,15.24 0 top
TEMP57  53.34,15.24 0 top
TEMP58  59.69,15.24 0 top
TEMP59  66.04,15.24 0 top
TEMP60  72.39,15.24 0 top
TEMP61  78.74,15.24 0 top
TEMP62  85.09,15.24 0 top
TEMP63  91.44,15.24 0 top
TEMP64  97.79,15.24 0 top

### Tracks (layer width: path | path; a pad name or v marks a point on that pad's centre or on a via)
A1
  Bottom 0.127: TEMP1.DQ TEMP1.DQ1
  Bottom 0.406: TEMP1.DQ1 2.54,99.06 5.08,96.52 30.48,96.52 JP1.1
A2  (via drill 0.6)
  Top 0.406: v8.89,99.06 8.89,97.79 9.53,97.16 33.02,97.16 33.66,96.52 JP1.2
  Bottom 0.127: TEMP2.DQ TEMP2.DQ1
  Bottom 0.406: TEMP2.DQ1 v8.89,99.06
A3  (via drill 0.6)
  Top 0.406: JP1.3 36.2,97.16 35.56,97.79 15.88,97.79 15.24,98.42 v15.24,99.06
  Bottom 0.127: TEMP3.DQ1 TEMP3.DQ
  Bottom 0.406: v15.24,99.06 TEMP3.DQ1
A4  (via drill 0.6)
  Top 0.406: v21.59,99.06 22.23,98.42 38.1,98.42 38.73,97.79 JP1.4
  Bottom 0.127: TEMP4.DQ TEMP4.DQ1
  Bottom 0.406: TEMP4.DQ1 v21.59,99.06
A5
  Bottom 0.127: TEMP5.DQ1 TEMP5.DQ
  Bottom 0.406: JP1.5 41.27,96.52 40.64,97.16 28.57,97.16 27.94,97.79 TEMP5.DQ1
A6
  Bottom 0.127: TEMP6.DQ1 TEMP6.DQ
  Bottom 0.406: JP1.6 43.81,97.16 43.18,97.79 34.92,97.79 34.29,98.42 TEMP6.DQ1
A7
  Bottom 0.127: TEMP7.DQ1 TEMP7.DQ
  Bottom 0.406: JP1.7 46.35,97.79 45.72,98.42 41.27,98.42 40.64,99.06 TEMP7.DQ1
A8
  Bottom 0.127: TEMP8.DQ1 TEMP8.DQ
  Bottom 0.406: TEMP8.DQ1 46.99,99.06 48.9,97.16 JP1.8
A9
  Bottom 0.127: TEMP9.DQ1 TEMP9.DQ
  Bottom 0.406: TEMP9.DQ1 53.34,99.06 51.44,97.16 JP1.9
A10
  Bottom 0.127: TEMP10.DQ TEMP10.DQ1
  Bottom 0.406: JP1.10 53.98,97.79 54.61,98.42 59.05,98.42 59.69,99.06 TEMP10.DQ1
A11
  Bottom 0.127: TEMP11.DQ1 TEMP11.DQ
  Bottom 0.406: TEMP11.DQ1 66.04,98.42 65.41,97.79 57.15,97.79 56.52,97.16 JP1.11
A12
  Bottom 0.127: TEMP12.DQ1 TEMP12.DQ
  Bottom 0.406: JP1.12 59.05,96.52 59.69,97.16 71.75,97.16 72.39,97.79 TEMP12.DQ1
A13  (via drill 0.6)
  Top 0.406: v78.74,99.06 78.11,98.42 62.23,98.42 61.59,97.79 JP1.13
  Bottom 0.127: TEMP13.DQ TEMP13.DQ1
  Bottom 0.406: TEMP13.DQ1 v78.74,99.06
A14  (via drill 0.6)
  Top 0.406: v85.09,99.06 85.09,98.42 84.45,97.79 64.77,97.79 64.14,97.16 JP1.14
  Bottom 0.127: TEMP14.DQ TEMP14.DQ1
  Bottom 0.406: TEMP14.DQ1 v85.09,99.06
A15  (via drill 0.6)
  Top 0.406: v91.44,99.06 91.44,97.79 90.81,97.16 67.31,97.16 66.67,96.52 JP1.15
  Bottom 0.127: TEMP15.DQ TEMP15.DQ1
  Bottom 0.406: TEMP15.DQ1 v91.44,99.06
A16
  Bottom 0.127: TEMP16.DQ TEMP16.DQ1
  Bottom 0.406: TEMP16.DQ1 97.79,99.06 95.25,96.52 69.85,96.52 JP1.16
B1
  Bottom 0.127: TEMP17.DQ TEMP17.DQ1
  Bottom 0.406: TEMP17.DQ2 2.54,90.17 5.08,92.71 30.48,92.71 JP2.1
B2  (via drill 0.6)
  Top 0.406: v8.89,90.17 8.89,91.44 9.53,92.08 33.02,92.08 33.66,92.71 JP2.2
  Bottom 0.127: TEMP18.DQ TEMP18.DQ1
  Bottom 0.406: TEMP18.DQ2 v8.89,90.17
B3  (via drill 0.6)
  Top 0.406: v15.24,90.17 15.24,90.81 15.88,91.44 35.56,91.44 36.2,92.08 JP2.3
  Bottom 0.127: TEMP19.DQ TEMP19.DQ1
  Bottom 0.406: TEMP19.DQ2 v15.24,90.17
B4  (via drill 0.6)
  Top 0.406: v21.59,90.17 22.23,90.81 38.1,90.81 38.73,91.44 JP2.4
  Bottom 0.127: TEMP20.DQ TEMP20.DQ1
  Bottom 0.406: TEMP20.DQ2 v21.59,90.17
B5
  Bottom 0.127: TEMP21.DQ TEMP21.DQ1
  Bottom 0.406: JP2.5 41.27,92.71 40.64,92.08 28.57,92.08 27.94,91.44 TEMP21.DQ2
B6
  Bottom 0.127: TEMP22.DQ TEMP22.DQ1
  Bottom 0.406: JP2.6 43.81,92.08 43.18,91.44 34.92,91.44 34.29,90.81 TEMP22.DQ2
B7
  Bottom 0.127: TEMP23.DQ TEMP23.DQ1
  Bottom 0.406: TEMP23.DQ2 40.64,90.17 41.27,90.81 45.72,90.81 46.35,91.44 JP2.7
B8
  Bottom 0.127: TEMP24.DQ TEMP24.DQ1
  Bottom 0.406: TEMP24.DQ2 46.99,90.17 48.9,92.08 JP2.8
B9
  Bottom 0.127: TEMP25.DQ TEMP25.DQ1
  Bottom 0.406: TEMP25.DQ2 53.34,90.17 51.44,92.08 JP2.9
B10
  Bottom 0.127: TEMP26.DQ TEMP26.DQ1
  Bottom 0.406: TEMP26.DQ2 59.69,90.17 59.05,90.81 54.61,90.81 53.98,91.44 JP2.10
B11
  Bottom 0.127: TEMP27.DQ TEMP27.DQ1
  Bottom 0.406: JP2.11 56.52,92.08 57.15,91.44 65.41,91.44 66.04,90.81 TEMP27.DQ2
B12
  Bottom 0.127: TEMP28.DQ TEMP28.DQ1
  Bottom 0.406: JP2.12 59.05,92.71 59.69,92.08 71.75,92.08 72.39,91.44 TEMP28.DQ2
B13  (via drill 0.6)
  Top 0.406: v78.74,90.17 78.11,90.81 62.23,90.81 61.59,91.44 JP2.13
  Bottom 0.127: TEMP29.DQ TEMP29.DQ1
  Bottom 0.406: TEMP29.DQ2 v78.74,90.17
B14  (via drill 0.6)
  Top 0.406: v85.09,90.17 85.09,90.81 84.45,91.44 64.77,91.44 64.14,92.08 JP2.14
  Bottom 0.127: TEMP30.DQ TEMP30.DQ1
  Bottom 0.406: TEMP30.DQ2 v85.09,90.17
B15  (via drill 0.6)
  Top 0.406: v91.44,90.17 91.44,91.44 90.81,92.08 67.31,92.08 66.67,92.71 JP2.15
  Bottom 0.127: TEMP31.DQ TEMP31.DQ1
  Bottom 0.406: TEMP31.DQ2 v91.44,90.17
B16
  Bottom 0.127: TEMP32.DQ TEMP32.DQ1
  Bottom 0.406: TEMP32.DQ2 97.79,90.17 95.25,92.71 69.85,92.71 JP2.16
C1
  Bottom 0.127: TEMP33.DQ TEMP33.DQ1
  Bottom 0.406: TEMP33.DQ1 2.54,35.56 5.08,33.02 30.48,33.02 JP3.1
C2  (via drill 0.6)
  Top 0.406: JP3.2 33.66,33.02 33.02,33.66 10.79,33.66 v8.89,35.56
  Bottom 0.127: TEMP34.DQ1 TEMP34.DQ
  Bottom 0.406: v8.89,35.56 TEMP34.DQ1
C3  (via drill 0.6)
  Top 0.406: JP3.3 36.2,33.66 35.56,34.29 16.51,34.29 v15.24,35.56
  Bottom 0.127: TEMP35.DQ1 TEMP35.DQ
  Bottom 0.406: v15.24,35.56 TEMP35.DQ1
C4  (via drill 0.6)
  Top 0.406: JP3.4 38.73,34.29 38.1,34.92 22.23,34.92 v21.59,35.56
  Bottom 0.127: TEMP36.DQ1 TEMP36.DQ
  Bottom 0.406: v21.59,35.56 TEMP36.DQ1
C5
  Bottom 0.127: TEMP37.DQ TEMP37.DQ1
  Bottom 0.406: TEMP37.DQ1 27.94,34.29 28.57,33.66 40.64,33.66 41.27,33.02 JP3.5
C6
  Bottom 0.127: TEMP38.DQ TEMP38.DQ1
  Bottom 0.406: TEMP38.DQ1 34.29,34.92 34.92,34.29 43.18,34.29 43.81,33.66 JP3.6
C7
  Bottom 0.127: TEMP39.DQ TEMP39.DQ1
  Bottom 0.406: TEMP39.DQ1 40.64,35.56 41.27,34.92 45.72,34.92 46.35,34.29 JP3.7
C8
  Bottom 0.127: TEMP40.DQ TEMP40.DQ1
  Bottom 0.406: TEMP40.DQ1 46.99,35.56 48.9,33.66 JP3.8
C9
  Bottom 0.127: TEMP41.DQ TEMP41.DQ1
  Bottom 0.406: TEMP41.DQ1 53.34,35.56 51.44,33.66 JP3.9
C10
  Bottom 0.127: TEMP42.DQ1 TEMP42.DQ
  Bottom 0.406: JP3.10 53.98,34.29 54.61,34.92 59.05,34.92 59.69,35.56 TEMP42.DQ1
C11
  Bottom 0.127: TEMP43.DQ1 TEMP43.DQ
  Bottom 0.406: JP3.11 56.52,33.66 57.15,34.29 65.41,34.29 66.04,34.92 TEMP43.DQ1
C12
  Bottom 0.127: TEMP44.DQ1 TEMP44.DQ
  Bottom 0.406: JP3.12 59.05,33.02 59.69,33.66 71.75,33.66 72.39,34.29 TEMP44.DQ1
C13  (via drill 0.6)
  Top 0.406: v78.74,35.56 78.11,34.92 62.23,34.92 61.59,34.29 JP3.13
  Bottom 0.127: TEMP45.DQ TEMP45.DQ1
  Bottom 0.406: TEMP45.DQ1 v78.74,35.56
C14  (via drill 0.6)
  Top 0.406: JP3.14 64.14,33.66 64.77,34.29 84.45,34.29 85.09,34.92 v85.09,35.56
  Bottom 0.127: TEMP46.DQ1 TEMP46.DQ
  Bottom 0.406: v85.09,35.56 TEMP46.DQ1
C15  (via drill 0.6)
  Top 0.406: v91.44,35.56 91.44,34.29 90.81,33.66 67.31,33.66 66.67,33.02 JP3.15
  Bottom 0.127: TEMP47.DQ TEMP47.DQ1
  Bottom 0.406: TEMP47.DQ1 v91.44,35.56
C16
  Bottom 0.127: TEMP48.DQ1 TEMP48.DQ
  Bottom 0.406: JP3.16 69.85,33.02 95.25,33.02 97.79,35.56 TEMP48.DQ1
D1
  Bottom 0.127: TEMP49.DQ TEMP49.DQ1
  Bottom 0.406: TEMP49.DQ2 2.54,26.67 5.08,29.21 30.48,29.21 JP4.1
D2  (via drill 0.6)
  Top 0.406: v8.89,26.67 10.79,28.57 33.02,28.57 33.66,29.21 JP4.2
  Bottom 0.127: TEMP50.DQ TEMP50.DQ1
  Bottom 0.406: TEMP50.DQ2 v8.89,26.67
D3  (via drill 0.6)
  Top 0.406: v15.24,26.67 16.51,27.94 35.56,27.94 36.2,28.57 JP4.3
  Bottom 0.127: TEMP51.DQ TEMP51.DQ1
  Bottom 0.406: TEMP51.DQ2 v15.24,26.67
D4  (via drill 0.6)
  Top 0.406: v21.59,26.67 22.23,27.3 38.1,27.3 38.73,27.94 JP4.4
  Bottom 0.127: TEMP52.DQ TEMP52.DQ1
  Bottom 0.406: TEMP52.DQ2 v21.59,26.67
D5
  Bottom 0.127: TEMP53.DQ TEMP53.DQ1
  Bottom 0.406: JP4.5 41.27,29.21 40.64,28.57 28.57,28.57 27.94,27.94 TEMP53.DQ2
D6
  Bottom 0.127: TEMP54.DQ TEMP54.DQ1
  Bottom 0.406: TEMP54.DQ2 34.29,27.3 34.92,27.94 43.18,27.94 43.81,28.57 JP4.6
D7
  Bottom 0.127: TEMP55.DQ TEMP55.DQ1
  Bottom 0.406: TEMP55.DQ2 40.64,26.67 41.27,27.3 45.72,27.3 46.35,27.94 JP4.7
D8
  Bottom 0.127: TEMP56.DQ TEMP56.DQ1
  Bottom 0.406: JP4.8 48.9,28.57 46.99,26.67 TEMP56.DQ2
D9
  Bottom 0.127: TEMP57.DQ TEMP57.DQ1
  Bottom 0.406: TEMP57.DQ2 53.34,26.67 51.44,28.57 JP4.9
D10
  Bottom 0.127: TEMP58.DQ TEMP58.DQ1
  Bottom 0.406: TEMP58.DQ2 59.69,26.67 59.05,27.3 54.61,27.3 53.98,27.94 JP4.10
D11
  Bottom 0.127: TEMP59.DQ TEMP59.DQ1
  Bottom 0.406: JP4.11 56.52,28.57 57.15,27.94 65.41,27.94 66.04,27.3 TEMP59.DQ2
D12
  Bottom 0.127: TEMP60.DQ TEMP60.DQ1
  Bottom 0.406: JP4.12 59.05,29.21 59.69,28.57 71.75,28.57 72.39,27.94 TEMP60.DQ2
D13  (via drill 0.6)
  Top 0.406: v78.74,26.67 78.11,27.3 62.23,27.3 61.59,27.94 JP4.13
  Bottom 0.127: TEMP61.DQ TEMP61.DQ1
  Bottom 0.406: TEMP61.DQ2 v78.74,26.67
D14  (via drill 0.6)
  Top 0.406: v85.09,26.67 83.82,27.94 64.77,27.94 64.14,28.57 JP4.14
  Bottom 0.127: TEMP62.DQ TEMP62.DQ1
  Bottom 0.406: TEMP62.DQ2 v85.09,26.67
D15  (via drill 0.6)
  Top 0.406: v91.44,26.67 89.53,28.57 67.31,28.57 66.67,29.21 JP4.15
  Bottom 0.127: TEMP63.DQ TEMP63.DQ1
  Bottom 0.406: TEMP63.DQ2 v91.44,26.67
D16
  Bottom 0.127: TEMP64.DQ TEMP64.DQ1
  Bottom 0.406: TEMP64.DQ2 97.79,26.67 95.25,29.21 69.85,29.21 JP4.16
GND
  Top 0.406: TEMP10.GND1 TEMP11.GND1 TEMP12.GND1 TEMP13.GND1 TEMP14.GND1 TEMP15.GND1 TEMP16.GND1 | TEMP7.GND1 TEMP8.GND1 TEMP9.GND1 TEMP10.GND1 | TEMP7.GND1 TEMP6.GND1 TEMP5.GND1 TEMP4.GND1 TEMP3.GND1 TEMP2.GND1 TEMP1.GND1 J1.2 J1.1 TEMP17.GND2 | TEMP23.GND1 TEMP22.GND1 TEMP21.GND1 TEMP20.GND1 TEMP19.GND1 TEMP18.GND1 TEMP17.GND1 TEMP33.GND2 | TEMP23.GND1 TEMP24.GND1 TEMP25.GND1 TEMP26.GND1 | TEMP26.GND1 TEMP27.GND1 TEMP28.GND1 TEMP29.GND1 TEMP30.GND1 TEMP31.GND1 TEMP32.GND1 TEMP48.GND2 | TEMP64.GND1 TEMP63.GND1 TEMP62.GND1 TEMP61.GND1 TEMP60.GND1 TEMP59.GND1 TEMP58.GND1 TEMP57.GND1 TEMP56.GND1 TEMP55.GND1 TEMP54.GND1 TEMP53.GND1 TEMP52.GND1 TEMP51.GND1 TEMP50.GND1 TEMP49.GND1 | TEMP39.GND1 TEMP38.GND1 TEMP37.GND1 TEMP36.GND1 TEMP35.GND1 TEMP34.GND1 TEMP33.GND1 J3.2 J3.1 TEMP49.GND2 | TEMP39.GND1 TEMP40.GND1 TEMP41.GND1 TEMP42.GND1 | TEMP42.GND1 TEMP43.GND1 TEMP44.GND1 TEMP45.GND1 TEMP46.GND1 TEMP47.GND1 TEMP48.GND1 J4.2 J4.1 TEMP64.GND2 | TEMP58.GND2 59.69,27.94 60.33,28.57 60.33,33.66 59.69,34.29 TEMP42.GND1 | TEMP55.GND2 40.64,27.94 40.01,28.57 40.01,33.66 40.64,34.29 TEMP39.GND1 | TEMP39.GND2 TEMP23.GND1 | TEMP42.GND2 TEMP26.GND1 | 97.79,103.5 98.42,104.14 TEMP16.GND1 | TEMP23.GND2 40.64,91.44 40.01,92.08 40.01,97.16 40.64,97.79 TEMP7.GND1 | TEMP26.GND2 59.69,91.44 60.33,92.08 60.33,97.16 59.69,97.79 TEMP10.GND1 | TEMP32.GND2 J2.1 J2.2 TEMP16.GND1

### Text on the board
tNames: (c) john.hulth@geo.uio.no | Temperature board v4.0